# Altium schematic sheet Lockbox_Schematic_V2.3.SchDoc
size A; SheetNumber: 1; SheetTotal: 1
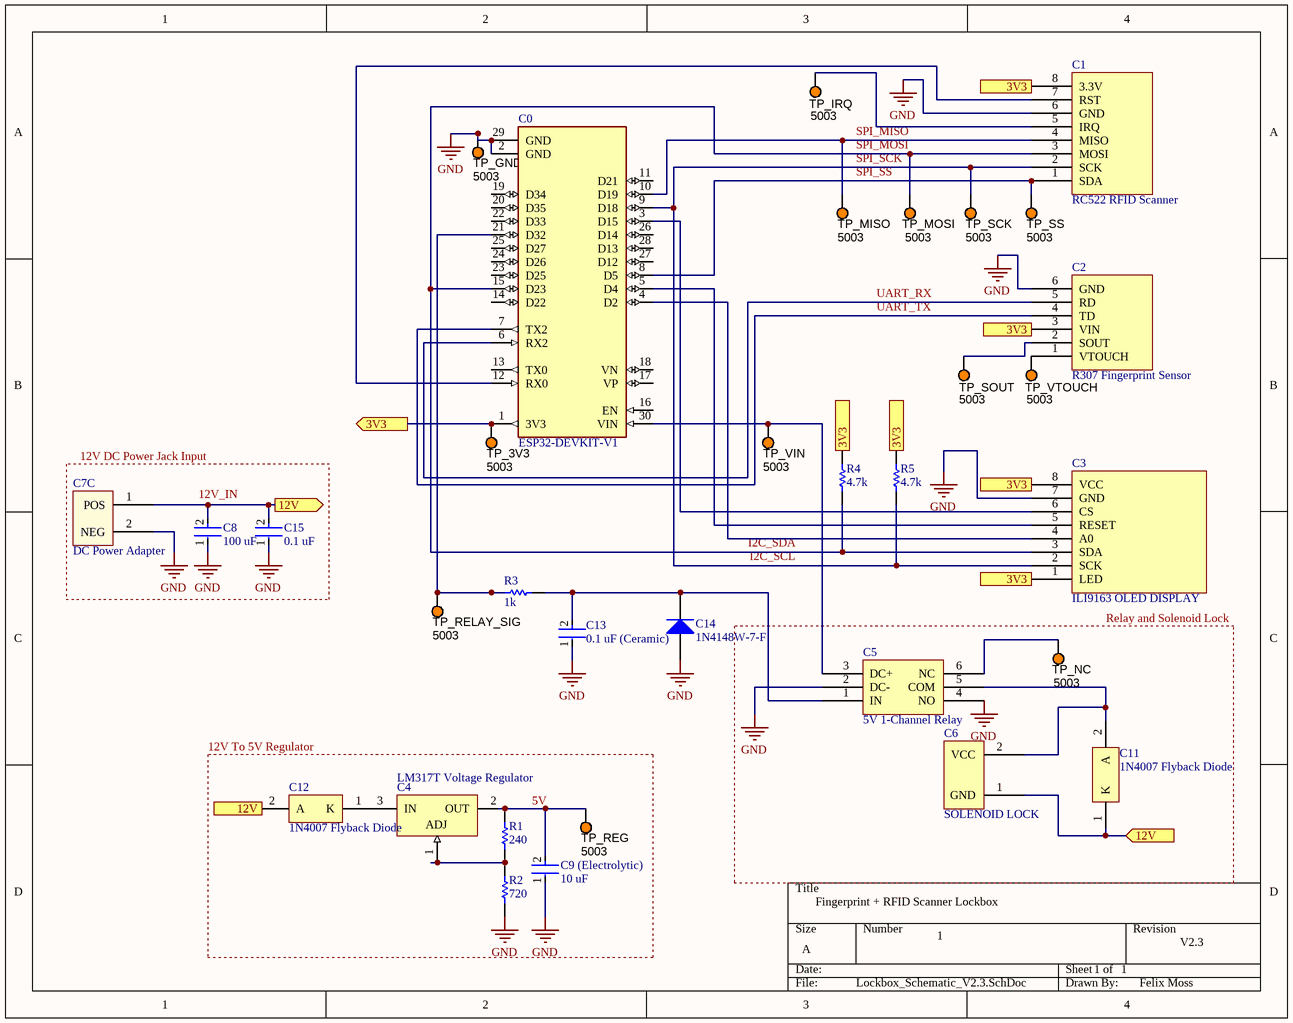
[diagram p0: Lockbox_Schematic_V2.3.SchDoc]

## Parts
C0  ESP32-DEVKIT-V1  [MODULE_ESP32_DEVKIT_V1]
C1  RC522 RFID Scanner
C2  R307 Fingerprint Sensor
C3  ILI9163 OLED DISPLAY
C4  LM317T Voltage Regulator  [TO-220]
C5  5V 1-Channel Relay
C6  SOLENOID LOCK  (mechanical)
C7  DC Power Adapter  (part C of 3)
C8  100 uF  [FP-562R5GAS10-MFG]
C9_(Electrolytic)  10 uF  [FP-562R5GAS10-MFG]
C11  1N4007 Flyback Diode  [ONSC-AXIAL_LEAD-2-59-10_P]
C12  1N4007 Flyback Diode  [ONSC-AXIAL_LEAD-2-59-10_P]
C13  0.1 uF (Ceramic)  [FP-562R5GAS10-MFG]
C14  1N4148W-7-F  [DIOD-SOD123-2_V]
C15  0.1 uF  [FP-562R5GAS10-MFG]
R1  value 240  (hidden comment: Resistor)
R2  value 720  (hidden comment: Resistor)
R3  value 1k  (hidden comment: Resistor)
R4  value 4.7k  (hidden comment: Resistor)
R5  value 4.7k  (hidden comment: Resistor)
TP_3V3  5003  [KSTN-5003]
TP_GND  5003  [KSTN-5003]
TP_IRQ  5003  [KSTN-5003]
TP_MISO  5003  [KSTN-5003]
TP_MOSI  5003  [KSTN-5003]
TP_NC  5003  [KSTN-5003]
TP_REG  5003  [KSTN-5003]
TP_RELAY_SIG  5003  [KSTN-5003]
TP_SCK  5003  [KSTN-5003]
TP_SOUT  5003  [KSTN-5003]
TP_SS  5003  [KSTN-5003]
TP_VIN  5003  [KSTN-5003]
TP_VTOUCH  5003  [KSTN-5003]

## Blocks framed on the sheet
Relay and Solenoid Lock: C5 C6 C11 TP_NC

## Ports
3V3 (in, see Lockbox_Schematic_V2.3[2B], Lockbox_Schematic_V2.3[3B], Lockbox_Schematic_V2.3[4A], Lockbox_Schematic_V2.3[4B]), 3V3 (in, see Lockbox_Schematic_V2.3[2B], Lockbox_Schematic_V2.3[3B], Lockbox_Schematic_V2.3[4A], Lockbox_Schematic_V2.3[4B], Lockbox_Schematic_V2.3[4C]), 3V3 (in, see Lockbox_Schematic_V2.3[2B], Lockbox_Schematic_V2.3[3B], Lockbox_Schematic_V2.3[4B], Lockbox_Schematic_V2.3[4C]), 3V3 (out, see Lockbox_Schematic_V2.3[3B], Lockbox_Schematic_V2.3[4A], Lockbox_Schematic_V2.3[4B], Lockbox_Schematic_V2.3[4C]), 12V (in, see Lockbox_Schematic_V2.3[1B], Lockbox_Schematic_V2.3[1D]), 12V (in, see Lockbox_Schematic_V2.3[1B], Lockbox_Schematic_V2.3[4D]), 12V (out, see Lockbox_Schematic_V2.3[1D], Lockbox_Schematic_V2.3[4D])

## Nets
GND: C0.2(GND) C0.29(GND) C1.6(GND) C2.6(GND) C3.7(GND) C5.2(DC-) C5.4(NO) C7.2(NEG) C8.1 C9_(Electrolytic).1 C13.1 C14.1(A) C15.1 R2.1 TP_GND.1
3V3: C0.1(3V3) C1.8(3.3V) C2.3(VIN) C3.1(LED) C3.8(VCC) R4.2 R5.2 TP_3V3.1 ; port 3V3
12V: C6.1(GND) C7.1(POS) C8.2 C11.1(K) C12.2(A) C15.2 ; port 12V
NetC0_3: C0.3(D15) C3.6(CS)
NetC0_4: C0.4(D2) C3.4(A0)
NetC0_5: C0.5(D4) C3.5(RESET)
NetC0_6: C0.6(RX2) C2.5(RD)
NetC0_7: C0.7(TX2) C2.4(TD)
NetC0_8: C0.8(D5) C1.1(SDA) TP_SS.1
NetC0_9: C0.9(D18) C1.2(SCK) C3.2(SCK) R5.1 TP_SCK.1
NetC0_10: C0.10(D19) C1.4(MISO) TP_MISO.1
NetC0_12: C0.12(RX0) C1.7(RST)
NetC0_15: C0.15(D23) C1.3(MOSI) C3.3(SDA) R4.1 TP_MOSI.1
NetC0_21: C0.21(D32) R3.1 TP_RELAY_SIG.1
NetC0_30: C0.30(VIN) C5.3(DC+) TP_VIN.1
NetC1_5: C1.5(IRQ) TP_IRQ.1
NetC2_1: C2.1(VTOUCH) TP_VTOUCH.1
NetC2_2: C2.2(SOUT) TP_SOUT.1
NetC4_1: C4.1(ADJ) R1.2 R2.2
NetC4_2: C4.2(OUT) C9_(Electrolytic).2 R1.1 TP_REG.1
NetC4_3: C4.3(IN) C12.1(K)
NetC5_1: C5.1(IN) C13.2 C14.2(K) R3.2
NetC5_5: C5.5(COM) C6.2(VCC) C11.2(A)
NetC5_6: C5.6(NC) TP_NC.1

Not connected (* = marked no-connect by the designer): C0 11(D21) 13(TX0) 14(D22) 16(EN) 17(VP) 18(VN) 19(D34) 20(D35) 22(D33) 23(D25) 24(D26) 25(D27) 26(D14) 27(D12) 28(D13)

## Notes on the sheet
- SPI_SCK
- SPI_MOSI
- SPI_MISO
- SPI_SS
- UART_RX
- UART_TX
- 12V DC Power Jack Input
- 12V_IN
- I2C_SDA
- I2C_SCL
- 12V To 5V Regulator
- 5V
- Fingerprint + RFID Scanner Lockbox
- 1
- V2.3
- Felix Moss

## Library data of the parts
C0 = ESP32-DEVKIT-V1: Dual core, Wi-Fi: 2.4 GHz up to 150 Mbits/s,BLE (Bluetooth Low Energy) and legacy Bluetooth, 32 bits, Up to 240 MHz; MF: Do it; Price: None; Availability: Not in stock; Package: None; MP: ESP32-DEVKIT-V1; Value: *; SnapEDA_Link: https://www.snapeda.com/parts/ESP32-DEVKIT-V1/Do+it/view-part/?ref=snap; Check_prices: https://www.snapeda.com/parts/ESP32-DEVKIT-V1/Do+it/view-part/?ref=eda
C1 = RFID-RC522: RFID Scanner
C2 = Fingerprint Sensor: Fingerprint Sensor Powered by AS608
C3 = LCD TFT DISPLAY: LCD-1217
C4 = CMP-0244-00444-1: 1.5A, 1.2V to 37V Adjustable Voltage Regulator, 3-Pin TO-220; PackageVersion: 2011; ComponentLink1URL: http://www.st.com; ComponentLink2URL: http://www.st.com/internet/com/TECHNICAL_RESOURCES/TECHNICAL_LITERATURE/DATASHEET/CD00000455.pdf; PackageDescription: TO, Thru-Hole, Vertical, Heatsink Mounted; 3 In-Line Leads; Pitch 2.54 mm; PackageReference: TO-220; ComponentLink1Description: Manufacturer URL; ComponentLink3URL: http://www.st.com/internet/com/TECHNICAL_RESOURCES/TECHNICAL_LITERATURE/PACKAGE_INFORMATION/CD00004649.pdf; DatasheetVersion: 1/11/2011; ComponentLink2Description: Datasheet; ComponentLink3Description: Package Specification
C5 = Power Relay
C6 = Solenoid Lock: 12V 1.1A Solenoid Lock
C8 C9_(Electrolytic) C13 C15 = CMP-02417-000061-1: CAP CER 10000PF 1KV Z5U RADIAL; Dissipation Factor: 2.5%; Tolerance: 20%; Lead Length: 29mm; Lead Diameter: 0.64mm; Lead/Base Style: Straight; Application(s): GENERAL PURPOSE; Capacitance: 10nF; Voltage Rating: 1kV; Voltage Rating (DC): 1kV; Depth: 4mm; Package Quantity: 250; Case/Package: Radial; Radiation Hardening: No; Diameter: 12.4mm; Dielectric: Z5U; Series: Cera-Mite 562R; Height: 0.25inch; Length: 2inch; Resistor Type: Ceramic; Width: 4mm; Contact Plating: Tin; Height - Seated (Max): 0.613inch; Packaging: Bulk; Lead Free: Lead Free; Construction: RADIAL; Mount: Through Hole; RoHS Compliant: Yes; Termination: Radial; Min Operating Temperature: -55°C; Lead Pitch: 9.5mm; Weight: 0.01lb; Max Operating Temperature: 105°C; Voltage: 1kV
C11 C12 = CMP-0902-00142-1: Standard Recovery Rectifier, 2-Pin Axial_Lead, Pb-Free, Bulk Bag; Manufacturer: On Semiconductor; IO(rec) Max (A): 1; IFSM Max (A): 30; VRRM Max (V): 1000; ComponentLink3URL: http://www.onsemi.cn/pub_link/Collateral/59-10.PDF; PackageVersion: Rev. U, 02/2005; PackageDescription: 2-Pin, Axial Lead, Diameter 2.35 mm; PackageReference: AXIAL_LEAD-2-59-10; RoHS: TRUE; PartNumber: 1N4007; Packing: Bulk Bag; DatasheetVersion: Rev. 13; ComponentLink3Description: Package Specification; ComponentLink1Description: Manufacturer URL; ComponentLink2URL: http://www.onsemi.com/pub_link/Collateral/1N4001-D.PDF; ComponentLink1URL: http://www.onsemi.com/; Type: Standard Recovery; ComponentLink2Description: Datasheet; Mounting Technology: Through Hole
C14 = CMP-2000-04932-2: Fast Switching Diode, 100 V, 0.15 A, -65 to 150 degC, 2-Pin?SOD123, RoHS, Tape and Reel; Recovery Time: 4ns; Brand: DiodesIncorporated; Unit Weight: 0.000353oz; Max Surge Current: 2A; Peak Reverse Voltage: 100V; Ir - Reverse Current: 1uA; Vf - Forward Voltage: 1.25V; Configuration: Single; If - Forward Current: 0.15A; Product Category: Diodes-GeneralPurpose,Power,Switching; Operating Temperature Range: -65Cto+150C; Packaging: Reel; Manufacturer URL: http://www.diodes.com/; Maximum Operating Temperature: +150C; Height: 1.25mm; Minimum Operating Temperature: -65C; Product: SwitchingDiodes; Package URL: http://www.diodes.com/datasheets/ds18004.pdf; Type: SwitchingDiode; Package Reference: SOD123-2; Width: 1.7mm; Datasheet URL: http://www.farnell.com/datasheets/1915529.pdf; Datasheet Version: Rev. 24-2, 10/2013; Series: 1N4148; Factory Pack Quantity: 3000; Length: 2.85mm; RoHS: True; Manufacturer: DiodesIncorporated; Mounting Style: SMD/SMT; Package / Case: SOD-123
R1-R5 = Resistor: TC1: 0; SimulationGenericComponent: True; TC2: 0
TP_3V3 TP_GND TP_IRQ TP_MISO TP_MOSI TP_NC TP_REG TP_RELAY_SIG TP_SCK TP_SOUT TP_SS TP_VIN TP_VTOUCH = CMP-002-00037-2: Test Point, Orange, Height 4.6 mm, Tail Length 3 mm, 1-Pin THD, RoHS; Manufacturer: Keystone; Colour: Orange; Packaging: Bulk; Package Description: 1-Pin Through Hole Device, Dia 2.54 mm; Pins: 1; Package Reference: 5003; Datasheet Version: Jun-15; Case/Package: 5003; Mounting Technology: TH; Connector Type: TestPoint; Diameter: 2.54mm; Contact Material: Bronze; Datasheet URL: http://keyelco.com/userAssets/file/M65p56.pdf; Manufacturer URL: http://www.keyelco.com/; Package Quantity: 10; Contact Plating: Tin; RoHS Compliant: True